# Altium schematic sheet BatteryCharger.SchDoc
size Tabloid
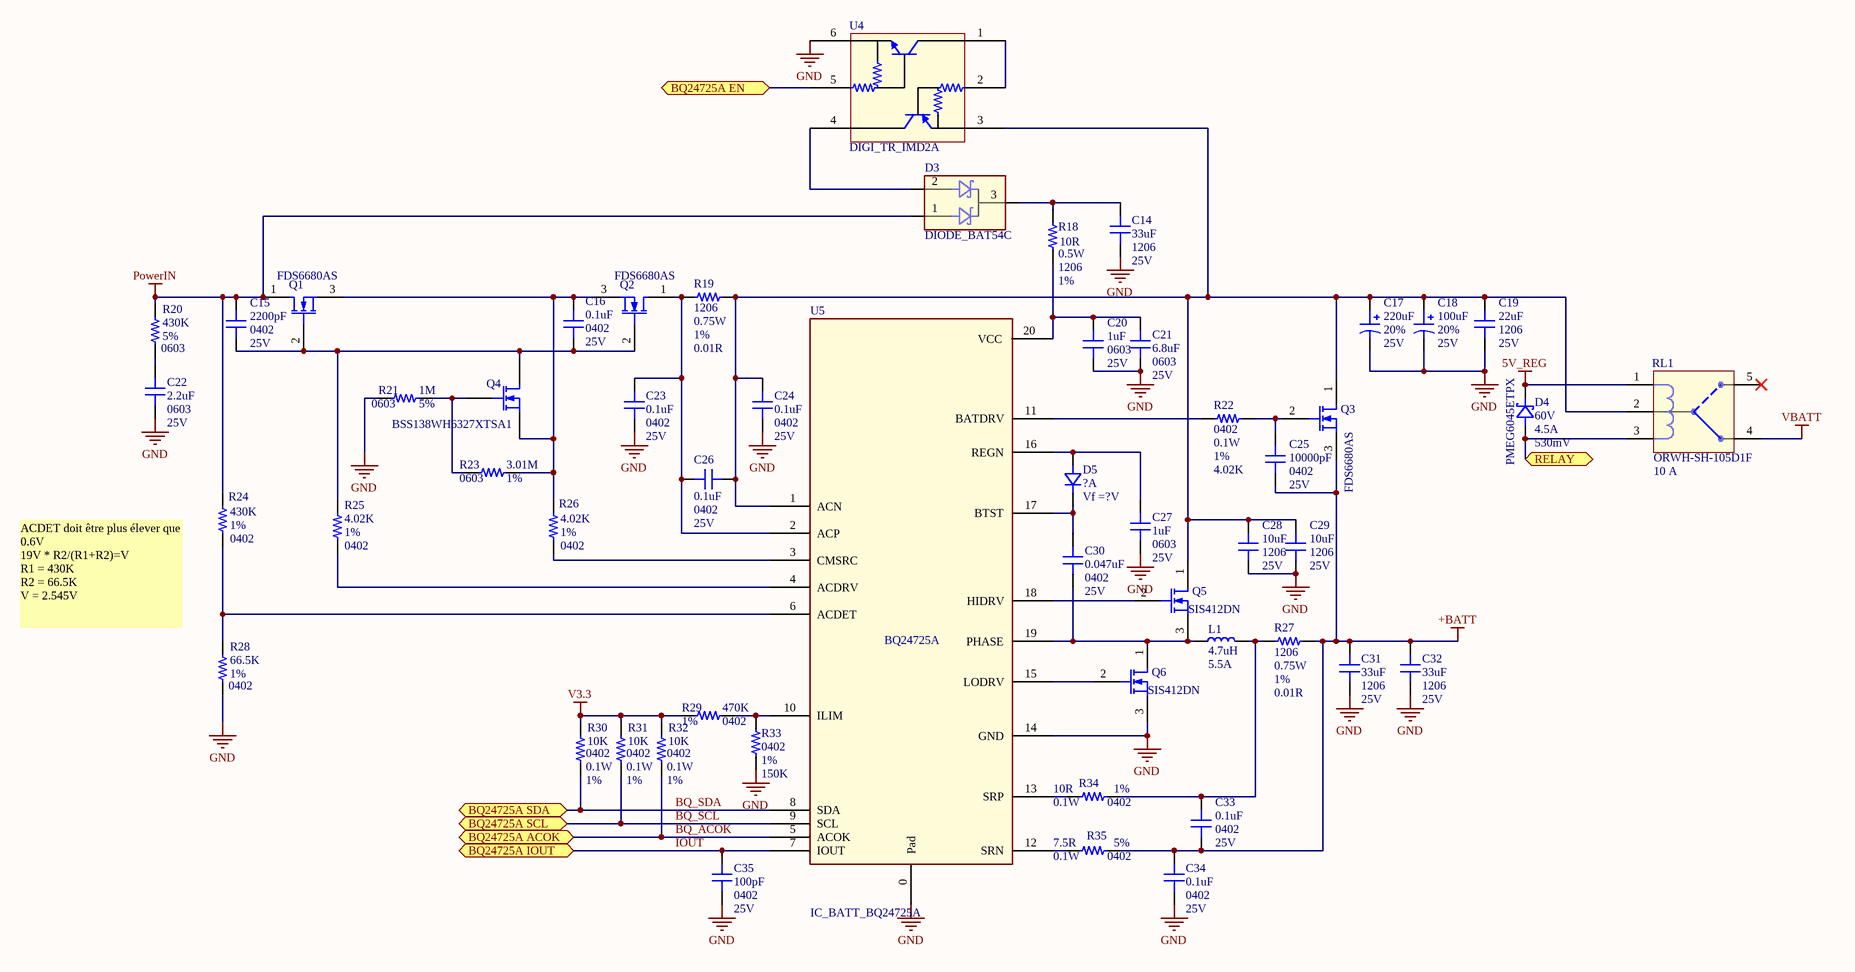
[diagram p0: BatteryCharger.SchDoc]

## Parts
C14  value 33uF  Package: 1206  Voltage: 25V  [CAP_1206]  (hidden comment: CAP_‎C3216JB1E336M160AC‎)
C15  value 2200pF  Package: 0402  Voltage: 25V  [CAP_0402]  (hidden comment: CAP_AC0402KRX7R8BB222‎)
C16  value 0.1uF  Package: 0402  Voltage: 25V  [CAP_0402]  (hidden comment: CAP_‎‎CL05A104KA5NNNC‎)
C17  value 220uF  Tolerance: 20%  Voltage: 25V  [CAP UWT 8x10]  (hidden comment: CAP_UWT1E221MNL1GS)
C18  value 100uF  Tolerance: 20%  Voltage: 25V  [CAP ALU - 6.3mm DIA]  (hidden comment: CAP_UWT1E101MCL1GS)
C19  value 22uF  Package: 1206  Voltage: 25V  [CAP_1206]  (hidden comment: CAP_‎‎CL31A226KAHNNNE‎)
C20  value 1uF  Package: 0603  Voltage: 25V  [CAP_0603]  (hidden comment: CAP_‎CL10A105KA8NNNC‎)
C21  value 6.8uF  Package: 0603  Voltage: 25V  [CAP_0603]  (hidden comment: CAP_‎‎‎C1608X5R1E685K080AC)
C22  value 2.2uF  Package: 0603  Voltage: 25V  [CAP_0603]  (hidden comment: CAP_‎‎GRM188R61E225KA12D‎)
C23  value 0.1uF  Package: 0402  Voltage: 25V  [CAP_0402]  (hidden comment: CAP_‎‎CL05A104KA5NNNC‎)
C24  value 0.1uF  Package: 0402  Voltage: 25V  [CAP_0402]  (hidden comment: CAP_‎‎CL05A104KA5NNNC‎)
C25  value 10000pF  Package: 0402  Voltage: 25V  [CAP_0402]  (hidden comment: CAP_‎CL05B103KA5NNNC‎)
C26  value 0.1uF  Package: 0402  Voltage: 25V  [CAP_0402]  (hidden comment: CAP_‎‎CL05A104KA5NNNC‎)
C27  value 1uF  Package: 0603  Voltage: 25V  [CAP_0603]  (hidden comment: CAP_‎CL10A105KA8NNNC‎)
C28  value 10uF  Package: 1206  Voltage: 25V  [CAP_1206]  (hidden comment: CAP_‎CL31A106KAHNFNE‎)
C29  value 10uF  Package: 1206  Voltage: 25V  [CAP_1206]  (hidden comment: CAP_‎CL31A106KAHNFNE‎)
C30  value 0.047uF  Package: 0402  Voltage: 25V  [CAP_0402]  (hidden comment: CAP_‎‎‎C0402C473K3RACAUTO‎)
C31  value 33uF  Package: 1206  Voltage: 25V  [CAP_1206]  (hidden comment: CAP_‎C3216JB1E336M160AC‎)
C32  value 33uF  Package: 1206  Voltage: 25V  [CAP_1206]  (hidden comment: CAP_‎C3216JB1E336M160AC‎)
C33  value 0.1uF  Package: 0402  Voltage: 25V  [CAP_0402]  (hidden comment: CAP_‎‎CL05A104KA5NNNC‎)
C34  value 0.1uF  Package: 0402  Voltage: 25V  [CAP_0402]  (hidden comment: CAP_‎‎CL05A104KA5NNNC‎)
C35  value 100pF  Package: 0402  Voltage: 25V  [CAP_0402]  (hidden comment: CAP_‎‎‎‎CC0402KRX7R8BB101‎)
D3  DIODE_BAT54C  [BAT54C]
D4  Voltage: 60V  Current: 4.5A  Vf: 530mV  Part number: PMEG6045ETPX  [DO-214AC_SOD128]  (hidden comment: DIODE_SCH_PMEG6045ETPX)
D5  Current: ?A  Vf: Vf =?V  [BAT54]  (hidden comment: DIODE BAT54)
L1  value 4.7uH  Current: 5.5A  [ASPI-0630LR]  (hidden comment: IND_ASPI-0630LR)
Q1  Part number: FDS6680AS  [SO-8 FDS6680AS]  (hidden comment: NMOS_FDS6680AS)
Q2  Part number: FDS6680AS  [SO-8 FDS6680AS]  (hidden comment: NMOS_FDS6680AS)
Q3  Part number: FDS6680AS  [SO-8 FDS6680AS]  (hidden comment: NMOS_FDS6680AS)
Q4  Part number: BSS138WH6327XTSA1  [PG-SOT-323]  (hidden comment: MOSFET-N)
Q5  NMOS_SIS412DN  [SiS412DN]  (value not drawn)
Q6  NMOS_SIS412DN  [SiS412DN]  (value not drawn)
R18  value 10R  Power: 0.5W  Package: 1206  Tolerance: 1%  [RES_1206]  (hidden comment: RES_CRM1206-FX-10R0ELF‎)
R19  value 0.01R  Package: 1206  Power: 0.75W  Tolerance: 1%  [RES_1206]  (hidden comment: RES_‎‎‎KRL1632E-M-R010-F-T5)
R20  value 430K  Package: 0603  Tolerance: 5%  [RES_0603]  (hidden comment: RES_‎‎‎‎RC0603JR-07430KL‎)
R21  value 1M  Package: 0603  Tolerance: 5%  [RES_0603]  (hidden comment: RES_‎‎‎ERA-6AEB4020V‎_1)
R22  value 4.02K  Package: 0402  Power: 0.1W  Tolerance: 1%  [RES_0402]  (hidden comment: RES_‎‎‎ERJ-2RKF4021X‎)
R23  value 3.01M  Package: 0603  Tolerance: 1%  [RES_0603]  (hidden comment: RES_‎‎‎‎RC0603FR-073M01L‎)
R24  value 430K  Package: 0402  Tolerance: 1%  [RES_0402]  (hidden comment: RES_RC0402FR-07430KL‎)
R25  value 4.02K  Package: 0402  Tolerance: 1%  [RES_0402]  (hidden comment: RES_‎‎‎ERJ-2RKF4021X‎)
R26  value 4.02K  Package: 0402  Tolerance: 1%  [RES_0402]  (hidden comment: RES_‎‎‎ERJ-2RKF4021X‎)
R27  value 0.01R  Package: 1206  Power: 0.75W  Tolerance: 1%  [RES_1206]  (hidden comment: RES_‎‎‎KRL1632E-M-R010-F-T5)
R28  value 66.5K  Package: 0402  Tolerance: 1%  [RES_0402]  (hidden comment: RES_‎‎‎‎RMCF0402FT66K5)
R29  value 470K  Package: 0402  Tolerance: 1%  [RES_0402]  (hidden comment: RES_MCS04020C4703FE000‎)
R30  value 10K  Package: 0402  Power: 0.1W  Tolerance: 1%  [RES_0402]  (hidden comment: RES_‎MCS0402MC1002FE000‎)
R31  value 10K  Package: 0402  Power: 0.1W  Tolerance: 1%  [RES_0402]  (hidden comment: RES_‎MCS0402MC1002FE000‎)
R32  value 10K  Package: 0402  Power: 0.1W  Tolerance: 1%  [RES_0402]  (hidden comment: RES_‎MCS0402MC1002FE000‎)
R33  value 150K  Package: 0402  Tolerance: 1%  [RES_0402]  (hidden comment: RES_‎‎‎MCS04020C1503FE000‎)
R34  value 10R  Power: 0.1W  Tolerance: 1%  Package: 0402  [RES_0402]  (hidden comment: RES_ERJ-2RKF10R0X‎)
R35  value 7.5R  Package: 0402  Power: 0.1W  Tolerance: 5%  [RES_0402]  (hidden comment: RES_‎‎‎ERJ-2GEJ7R5X‎)
RL1  Part number: ORWH-SH-105D1F  A max: 10 A  [ORWH-SH]  (hidden comment: Relay SPDT)
U4  DIGI_TR_IMD2A  [IMD2A]
U5  IC_BATT_BQ24725A  [bq24725A]

## Ports
BQ24725A ACOK, BQ24725A EN, BQ24725A IOUT, BQ24725A SCL, BQ24725A SDA, RELAY

## Nets
5V_REG: D4.2 RL1.1
+BATT: C25.2 C31.1 C32.1 C33.2 C34.1 Q3.3(S) R27.2 R35.2
GND: C14.2 C17.2 C18.2 C19.2 C20.2 C21.2 C22.2 C23.2 C24.2 C27.2 C28.2 C29.2 C31.2 C32.2 C34.2 C35.2 Q6.3(S) R21.1 R28.2 R33.1 U4.6 U5.0(Pad) U5.14(GND)
PowerIN: C15.1 D3.1 Q1.1(D) R20.1 R24.1
V3.3: R29.1 R30.1 R31.1 R32.1
VBATT: RL1.4
BQ24725A EN: U4.5 ; port BQ24725A EN
BQ_ACOK: R32.2 U5.5(ACOK) ; port BQ24725A ACOK
BQ_SCL: R31.2 U5.9(SCL) ; port BQ24725A SCL
BQ_SDA: R30.2 U5.8(SDA) ; port BQ24725A SDA
IOUT: C35.1 U5.7(IOUT) ; port BQ24725A IOUT
RELAY: D4.1 RL1.3 ; port RELAY
NetC14_1: C14.1 D3.3 R18.1
NetC15_2: C15.2 C16.2 Q1.2(G) Q2.2(G) Q4.3(D) R25.1
NetC16_1: C16.1 Q1.3(S) Q2.3(S) Q4.2(S) R23.2 R26.1
NetC17_1: C17.1 C18.1 C19.1 C24.1 C26.2 C28.1 C29.1 Q3.1(D) Q5.1(D) R19.2 RL1.2 U4.3 U5.1(ACN)
NetC20_1: C20.1 C21.1 R18.2 U5.20(VCC)
NetC22_1: C22.1 R20.2
NetC23_1: C23.1 C26.1 Q2.1(D) R19.1 U5.2(ACP)
NetC25_1: C25.1 Q3.2(G) R22.2
NetC27_1: C27.1 D5.1 U5.16(REGN)
NetC30_1: C30.1 D5.3 U5.17(BTST)
NetC30_2: C30.2 L1.1 Q5.3(S) Q6.1(D) U5.19(PHASE)
NetC33_1: C33.1 L1.2 R27.1 R34.2
NetD3_2: D3.2 U4.4
NetQ4_1: Q4.1(G) R21.2 R23.1
NetQ5_2: Q5.2(G) U5.18(HIDRV)
NetQ6_2: Q6.2(G) U5.15(LODRV)
NetR22_1: R22.1 U5.11(BATDRV)
NetR24_2: R24.2 R28.1 U5.6(ACDET)
NetR25_2: R25.2 U5.4(ACDRV)
NetR26_2: R26.2 U5.3(CMSRC)
NetR29_2: R29.2 R33.2 U5.10(ILIM)
NetR34_1: R34.1 U5.13(SRP)
NetR35_1: R35.1 U5.12(SRN)
NetU4_1: U4.1 U4.2

Not connected (* = marked no-connect by the designer): RL1 5*

## Notes on the sheet
- ACDET doit être plus élever que 0.6V
  19V * R2/(R1+R2)=V
  R1 = 430K
  R2 = 66.5K
  V = 2.545V
- Sheet Name
- Project Title
- Global Project
- Size
- Group
- Revision
- Date
- Sheet
- of
- Filename
- Designers

## Library data of the parts
C14 C31 C32 = CAP_‎C3216JB1E336M160AC‎: CAP CER 33uF 25V 1206; Part number: C3216JB1E336M160AC‎
C15 = CAP_AC0402KRX7R8BB222‎: CAP CER 2200PF 25V 0402; Part number: AC0402KRX7R8BB222‎
C16 C23 C24 C26 C33 C34 = CAP_‎‎CL05A104KA5NNNC‎: CAP CER 0.1uF 25V 0402; Part number: CL05A104KA5NNNC‎
C17 = CAP_UWT1E221MNL1GS: CAP ALU 220µF 25V; Part number: UWT1E221MNL1GS; Package: 8.30mm x 8.30mm
C18 = CAP_UWT1E101MCL1GS: CAP ALU 100µF 25V; Part number: UWT1E101MCL1GS; Package: 6.60mm x 6.60mm
C19 = CAP_‎‎CL31A226KAHNNNE‎: CAP CER 22uF 25V 1206; Part number: CL31A226KAHNNNE‎
C20 C27 = CAP_‎CL10A105KA8NNNC‎: CAP CER 1uF 25V 0603; Part number: CL10A105KA8NNNC‎
C21 = CAP_‎‎‎C1608X5R1E685K080AC: CAP CER 6.8uF 25V 0603; Part number: C1608X5R1E685K080AC
C22 = CAP_‎‎GRM188R61E225KA12D‎: CAP CER 2.2uF 25V 0603; Part number: GRM188R61E225KA12D‎
C25 = CAP_‎CL05B103KA5NNNC‎: CAP CER 10000pF 25V 0402; Part number: ‎CL05B103KA5NNNC‎
C28 C29 = CAP_‎CL31A106KAHNFNE‎: CAP CER 10uF 25V 1206; Part number: CL31A106KAHNFNE‎
C30 = CAP_‎‎‎C0402C473K3RACAUTO‎: CAP CER 0.047uF 25V 0402; Part number: ‎C0402C473K3RACAUTO‎
C35 = CAP_‎‎‎‎CC0402KRX7R8BB101‎: CAP CER 100pF 25V 0402; Part number: CC0402KRX7R8BB101‎
D3 = DIODE_BAT54C: Dual input Diode; Part number: BAT54C
D4 = DIODE_SCH_PMEG6045ETPX: Diode Schottky 60V 4.5A Surface Mount CFP5; Package: SOD-128
D5 = DIODE BAT54: Part number: BAT54C
L1 = IND_ASPI-0630LR: 4.7µH Shielded Molded Inductor 5.5A 35mOhm; Package: 7.20mm x 6.65mm; Part number: ASPI-0630LR
Q1-Q3 = NMOS_FDS6680AS: NMOS_N-Channel 30V 11.5A (Ta) 2.5W (Ta) Surface Mount 8-SOIC; Vgs: 20V; Package: PG-SOT323-3; Id: 11.5A; Vdss: 30V
Q4 = MOSFET-N: N-Channel MOSFET; Published: 8-Jun-2000; LatestRevisionDate: 17-Jul-2002; LatestRevisionNote: Re-released for DXP Platform.; PackageVersion: 1995/1996; PackageReference: E3; Publisher: Altium Limited; PackageDescription: TO, Flat Index; 3 In-Line, Axial Leads; Body Dia. 4.6mm; Lead Dia. 0.5 mm (max)
Q5 Q6 = NMOS_SIS412DN: NMOS_N-Channel 30V 12A (Tc) 3.2W (Ta), 15.6W (Tc); Vgs: 20V; Package: PowerPAK® 1212-8; Id: 12A; Vdss: 30V; Part number: SIS412DN
R18 = RES_CRM1206-FX-10R0ELF‎: RES 10R 1% 1/2W 1206; Part number: CRM1206-FX-10R0ELF‎
R19 R27 = RES_‎‎‎KRL1632E-M-R010-F-T5: RES 0.01R 1% 3/4W 1206; Part number: KRL1632E-M-R010-F-T5
R20 = RES_‎‎‎‎RC0603JR-07430KL‎: RES 430K 5% 1/10W 0603; Power: 0.1W; Part number: RC0603JR-07430KL‎
R21 = RES_‎‎‎ERA-6AEB4020V‎_1: RES 1M 5% 1/10W 0603; Power: 0.1W; Part number: ‎ERA-6AEB4020V‎
R22 = RES_‎‎‎ERJ-2RKF4021X‎: RES 4.02K 1% 1/10W 0402; Part number: ERJ-2RKF4021X‎
R23 = RES_‎‎‎‎RC0603FR-073M01L‎: RES 3.01M 1% 1/10W 0603; Power: 0.1W; Part number: RC0603FR-073M01L‎
R24 = RES_RC0402FR-07430KL‎: RES 430K 1% 1/16W 0402; Power: 0.0625W; Part number: RC0402FR-07430KL‎
R25 R26 = RES_‎‎‎ERJ-2RKF4021X‎: RES 4.02K 1% 1/10W 0402; Power: 0.1W; Part number: ERJ-2RKF4021X‎
R28 = RES_‎‎‎‎RMCF0402FT66K5: RES 66.5K 1% 1/16W 0402; Power: 0.0625W; Part number: RMCF0402FT66K5
R29 = RES_MCS04020C4703FE000‎: RES 470K 1% 1/10W 0402; Power: 0.1W; Part number: MCS04020C4703FE000‎
R30-R32 = RES_‎MCS0402MC1002FE000‎: RES 10K 1% 1/10W 0402; Part number: ‎MCS0402MC1002FE000‎
R33 = RES_‎‎‎MCS04020C1503FE000‎: RES 150K 1% 1/10W 0402; Power: 0.1W; Part number: MCS04020C1503FE000‎
R34 = RES_ERJ-2RKF10R0X‎: RES 10R 1% 1/10W 0402; Part number: ERJ-2RKF10R0X‎
R35 = RES_‎‎‎ERJ-2GEJ7R5X‎: RES 7.5R 5% 1/10W 0402; Part number: ERJ-2GEJ7R5X‎
U4 = DIGI_TR_IMD2A: Dual digital Transistor; Part number: IMD2A
U5 = IC_BATT_BQ24725A: Battery Charger; Part number: BQ24725A